# EAGLE schematic MiniBoard (EAGLE 9.6.2)
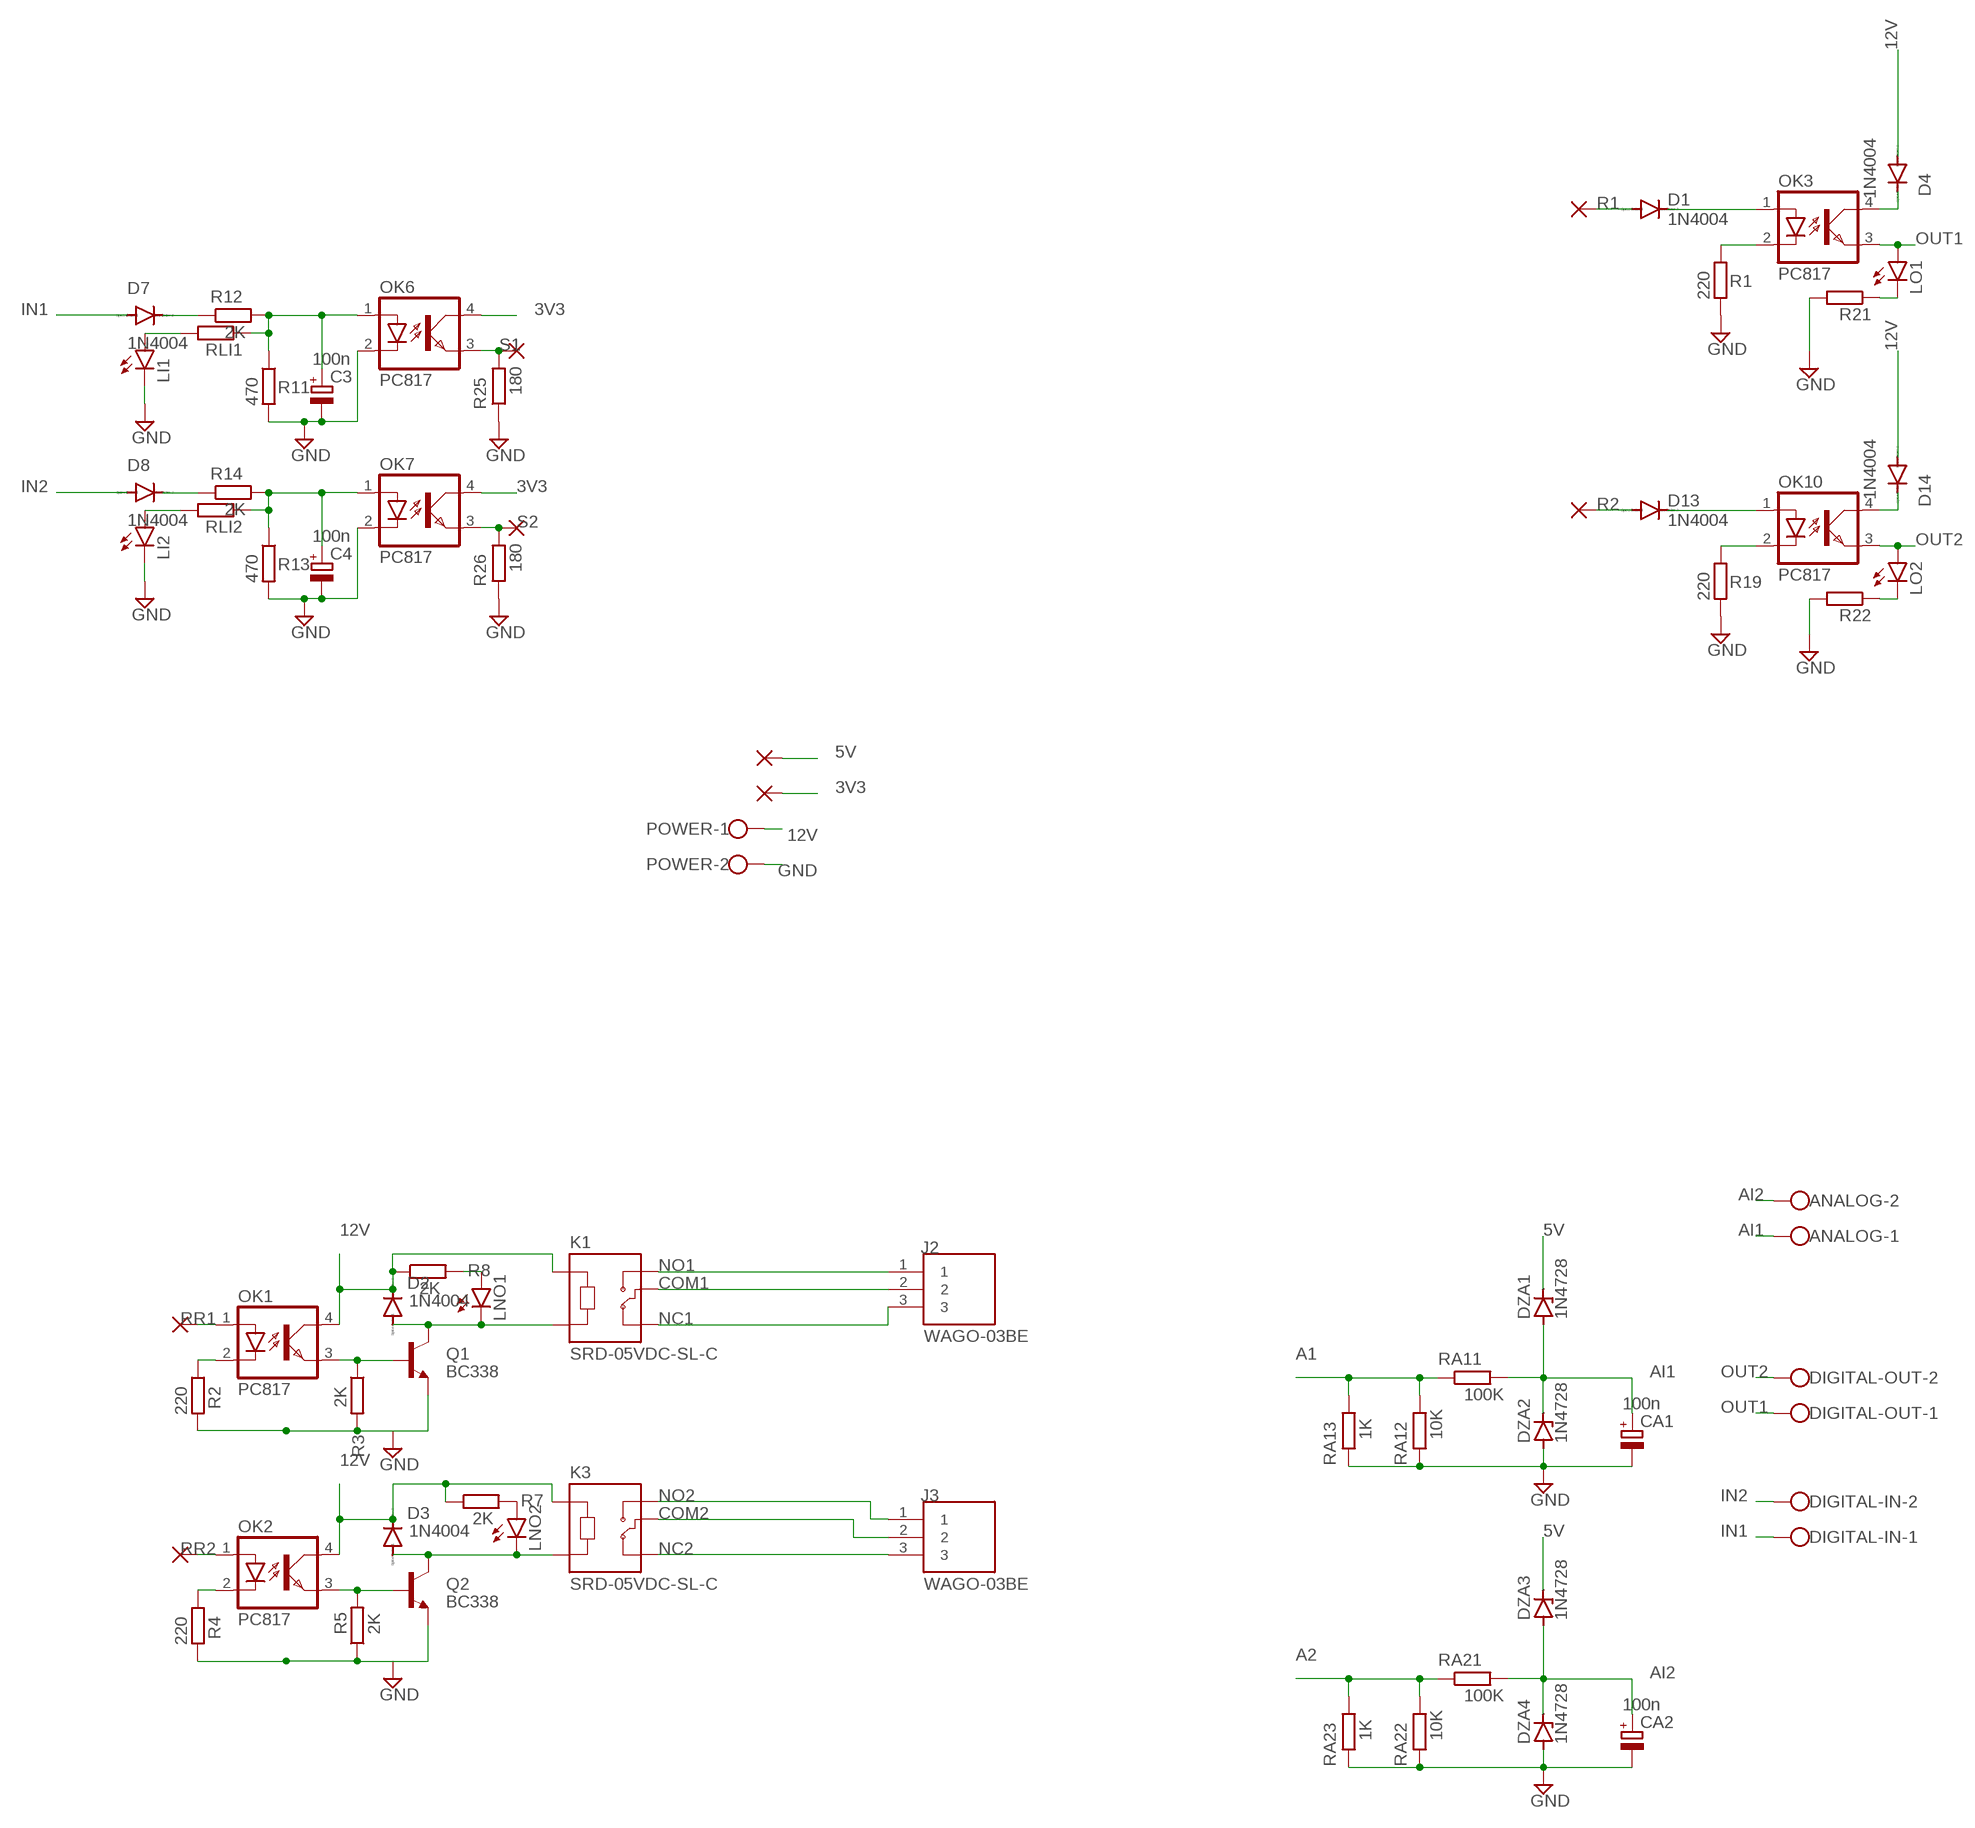
[diagram p0: schematic, sheet 1]

## Parts
ANALOG  W237-102  [W237-102]
C3  100n  CPOL-EUE5-6  [E5-6]
C4  100n  CPOL-EUE5-6  [E5-6]
CA1  100n  CPOL-EUE5-6  [E5-6]
CA2  100n  CPOL-EUE5-6  [E5-6]
D1  1N4004  [DO41-10]
D2  1N4004  [DO41-10]
D3  1N4004  [DO41-10]
D4  1N4004  [DO41-10]
D7  1N4004  [DO41-10]
D8  1N4004  [DO41-10]
D13  1N4004  [DO41-10]
D14  1N4004  [DO41-10]
DIGITAL-IN  W237-102  [W237-102]
DIGITAL-OUT  W237-102  [W237-102]
DZA1  1N4728  [DO41Z10]
DZA2  1N4728  [DO41Z10]
DZA3  1N4728  [DO41Z10]
DZA4  1N4728  [DO41Z10]
J2  WAGO-03BE  [CUI_TB006-508-03BE]
J3  WAGO-03BE  [CUI_TB006-508-03BE]
K1  SRD-05VDC-SL-C  [RELAY_SRD-05VDC-SL-C]
K3  SRD-05VDC-SL-C  [RELAY_SRD-05VDC-SL-C]
LI1  LED3MM  [LED3MM]
LI2  LED3MM  [LED3MM]
LNO1  LED3MM  [LED3MM]
LNO2  LED3MM  [LED3MM]
LO1  LED3MM  [LED3MM]
LO2  LED3MM  [LED3MM]
OK1  PC817  [DIL04]
OK2  PC817  [DIL04]
OK3  PC817  [DIL04]
OK6  PC817  [DIL04]
OK7  PC817  [DIL04]
OK10  PC817  [DIL04]
PAD1  WIREPAD1,6/0,9  [1,6/0,9]
PAD2  WIREPAD1,6/0,9  [1,6/0,9]
PAD3  WIREPAD1,6/0,9  [1,6/0,9]
PAD4  WIREPAD1,6/0,9  [1,6/0,9]
PAD5  WIREPAD1,6/0,9  [1,6/0,9]
PAD6  WIREPAD1,6/0,9  [1,6/0,9]
PAD79  WIREPAD1,6/0,9  [1,6/0,9]
PAD80  WIREPAD1,6/0,9  [1,6/0,9]
POWER  W237-102  [W237-102]
Q1  BC338  [TO92-EBC]
Q2  BC338  [TO92-EBC]
R1  220  R-EU_0309/12  [0309/12]
R2  220  R-EU_0309/12  [0309/12]
R3  2K  R-EU_0309/12  [0309/12]
R4  220  R-EU_0309/12  [0309/12]
R5  2K  R-EU_0309/12  [0309/12]
R7  2K  R-EU_0309/12  [0309/12]
R8  2K  R-EU_0309/12  [0309/12]
R11  470  R-EU_0309/12  [0309/12]
R12  2K  R-EU_0309/12  [0309/12]
R13  470  R-EU_0309/12  [0309/12]
R14  2K  R-EU_0309/12  [0309/12]
R19  220  R-EU_0309/12  [0309/12]
R21  R-EU_0309/12  [0309/12]
R22  R-EU_0309/12  [0309/12]
R25  180  R-EU_0309/12  [0309/12]
R26  180  R-EU_0309/12  [0309/12]
RA11  100K  R-EU_0309/12  [0309/12]
RA12  10K  R-EU_0309/12  [0309/12]
RA13  1K  R-EU_0309/12  [0309/12]
RA21  100K  R-EU_0309/12  [0309/12]
RA22  10K  R-EU_0309/12  [0309/12]
RA23  1K  R-EU_0309/12  [0309/12]
RLI1  R-EU_0309/12  [0309/12]
RLI2  R-EU_0309/12  [0309/12]

## Nets
3V3: OK6.4(COL) OK7.4(COL) PAD5.1(P)
5V: DZA1.C DZA3.C PAD6.1(P)
12V: D2.C D3.C D4.A D14.A K1.A1 K3.A1 OK1.4(COL) OK2.4(COL) POWER.1 R7.1 R8.1
A1: RA11.1 RA12.2 RA13.2
A2: RA21.1 RA22.2 RA23.2
AI1: ANALOG.1 CA1.+ DZA1.A DZA2.C RA11.2
AI2: ANALOG.2 CA2.+ DZA3.A DZA4.C RA21.2
COM1: J2.2 K1.COM
COM2: J3.2 K3.COM
GND: C3.- C4.- CA1.- CA2.- DZA2.A DZA4.A LI1.K(C) LI2.K(C) OK6.2(C) OK7.2(C) POWER.2 Q1.E Q2.E R1.2 R2.2 R3.2 R4.2 R5.1 R11.2 R13.2 R19.2 R21.2 R22.2 R25.1 R26.1 RA12.1 RA13.1 RA22.1 RA23.1
IN1: D7.A DIGITAL-IN.1
IN2: D8.A DIGITAL-IN.2
N$1: OK2.2(C) R4.1
N$2: OK1.2(C) R2.1
N$3: OK1.3(EMIT) Q1.B R3.1
N$4: D3.A K3.A2 LNO2.K(C) Q2.C
N$6: OK2.3(EMIT) Q2.B R5.2
N$7: LNO2.A R7.2
N$10: LNO1.A R8.2
N$11: D2.A K1.A2 LNO1.K(C) Q1.C
N$15: D1.C OK3.1(A)
N$16: OK3.2(C) R1.1
N$18: D4.C OK3.4(COL)
N$19: C3.+ OK6.1(A) R11.1 R12.2 RLI1.1
N$20: D7.C R12.1
N$21: C4.+ OK7.1(A) R13.1 R14.2 RLI2.1
N$22: D8.C R14.1
N$24: LI2.A RLI2.2
N$26: D13.C OK10.1(A)
N$27: OK10.2(C) R19.1
N$29: LI1.A RLI1.2
N$30: LO1.K(C) R21.1
N$31: LO2.K(C) R22.1
N$52: D14.C OK10.4(COL)
NC1: J2.3 K1.NC
NC2: J3.3 K3.NC
NO1: J2.1 K1.NO
NO2: J3.1 K3.NO
OUT1: DIGITAL-OUT.1 LO1.A OK3.3(EMIT)
OUT2: DIGITAL-OUT.2 LO2.A OK10.3(EMIT)
R1: D1.A PAD79.1(P)
R2: D13.A PAD80.1(P)
RR1: OK1.1(A) PAD4.1(P)
RR2: OK2.1(A) PAD3.1(P)
S1: OK6.3(EMIT) PAD1.1(P) R25.2
S2: OK7.3(EMIT) PAD2.1(P) R26.2

## Library data of the parts
ANALOG DIGITAL-IN DIGITAL-OUT POWER = con-wago-500:W237-102: WAGO SCREW CLAMP; MPN: 237-102; OC_FARNELL: unknown; OC_NEWARK: 70K9898
C3 C4 CA1 CA2 = rcl-ws:CPOL-EU: POLARIZED CAPACITOR, European symbol; SPICEPREFIX: C
D1-D4 D7 D8 D13 D14 = diode:1N4004: DIODE general purpose rectifier, 1 A
DZA1-DZA4 = diode-ws:1N4728: Z DIODE 3.3 V, 1W, 5 percent
J2 J3 = TB006-508-03BE:WAGO-03BE: Check availability <https://pricing.snapeda.com/parts/TB006-508-03BE/Same%20Sky/view-part?ref=eda>; AVAILABILITY: In Stock; CHECK_PRICES: https://www.snapeda.com/parts/TB006-508-03BE/Same+Sky/view-part/?ref=eda; DESCRIPTION: 2~24 Poles, Screw Type, Horizontal, 5.08 Pitch, 26~14 (AWG), Terminal Block Connector; MF: Same Sky; MP: TB006-508-03BE; PACKAGE: None; PRICE: None; SNAPEDA_LINK: https://www.snapeda.com/parts/TB006-508-03BE/Same+Sky/view-part/?ref=snap
K1 K3 = SRD-05VDC-SL-C:SRD-05VDC-SL-C: 5V Trigger Relay Module For Arduino And Raspberry Pi 5V Trigger Relay Module For Arduino And Raspberry Pi Check availability <https://pricing.snapeda.com/parts/SRD-05VDC-SL-C/Songle%20Relay/view-part?ref=eda>; AVAILABILITY: In Stock; CHECK_PRICES: https://www.snapeda.com/parts/SRD-05VDC-SL-C/Songle+Relay/view-part/?ref=eda; DESCRIPTION: 5V Trigger Relay Module For Arduino And Raspberry Pi 5V Trigger Relay Module For Arduino And Raspberry Pi; MF: Songle Relay; MP: SRD-05VDC-SL-C; PACKAGE: NON STANDARD-5 Songle Relay; PRICE: None; SNAPEDA_LINK: https://www.snapeda.com/parts/SRD-05VDC-SL-C/Songle+Relay/view-part/?ref=snap
LI1 LI2 LNO1 LNO2 LO1 LO2 = led_WS:LED: LED OSRAM: - CHIPLED LG R971, LG N971, LY N971, LG Q971, LY Q971, LO R971, LY R971 LH N974, LH R974 LS Q976, LO Q976, LY Q976 LO Q996 - Hyper CHIPLED LW Q18S LB Q993, LB Q99A, LB R99A - SideLED LS A670, LO A670, LY A670, LG A670, LP A670 LB A673, LV A673, LT A673, LW A673 LH A674 LY A675 LS A676, LA A676, LO A676, LY A676, LW A676 LS A679, LY A679, LG A679 - Hyper Micro SIDELED® LS Y876, LA Y876, LO Y876, LY Y876 LT Y87S - SmartLED LW L88C, LW L88S LB L89C, LB L89S, LG L890 LS L89K, LO L89K, LY L89K LS L896, LA L896, LO L896, LY L896 - TOPLED LS T670, LO T670, LY T670, LG T670, LP T670 LSG T670, LSP T670, LSY T670, LOP T670, LYG T670 LG T671, LOG T671, LSG T671 LB T673, LV T673, LT T673, LW T673 LH T674 LS T676, LA T676, LO T676, LY T676, LB T676, LH T676, LSB T676, LW T676 LB T67C, LV T67C, LT T67C, LS T67K, LO T67K, LY T67K, LW E67C LS E67B, LA E67B, LO E67B, LY E67B, LB E67C, LV E67C, LT E67C LW T67C LS T679, LY T679, LG T679 LS T770, LO T770, LY T770, LG T770, LP T770 LB T773, LV T773, LT T773, LW T773 LH T774 LS E675, LA E675, LY E675, LS T675 LS T776, LA T776, LO T776, LY T776, LB T776 LHGB T686 LT T68C, LB T68C - Hyper Mini TOPLED® LB M676 - Mini TOPLED Santana® LG M470 LS M47K, LO M47K, LY M47K Source: http://www.osram.convergy.de LUXEON: - LUMILED® LXK2-PW12-R00, LXK2-PW12-S00, LXK2-PW14-U00, LXK2-PW14-V00 LXK2-PM12-R00, LXK2-PM12-S00, LXK2-PM14-U00 LXK2-PE12-Q00, LXK2-PE12-R00, LXK2-PE12-S00, LXK2-PE14-T00, LXK2-PE14-U00 LXK2-PB12-K00, LXK2-PB12-L00, LXK2-PB12-M00, LXK2-PB14-N00, LXK2-PB14-P00, LXK2-PB14-Q00 LXK2-PR12-L00, LXK2-PR12-M00, LXK2-PR14-Q00, LXK2-PR14-R00 LXK2-PD12-Q00, LXK2-PD12-R00, LXK2-PD12-S00 LXK2-PH12-R00, LXK2-PH12-S00 LXK2-PL12-P00, LXK2-PL12-Q00, LXK2-PL12-R00 Source: www.luxeon.com KINGBRIGHT: KA-3528ASYC Source: www.kingbright.com
OK1-OK3 OK6 OK7 OK10 = optocoupler:PC817: SHARP OPTO COUPLER; MPN: PC817X4J000F; OC_FARNELL: 9707727; OC_NEWARK: 97K7059
PAD1-PAD6 PAD79 PAD80 = wirepad-ws:WIREPAD: Wire PAD connect wire on PCB
Q1 Q2 = transistor-npn:BC338*: NPN Transistor
R1-R5 R7 R8 R11-R14 R19 R21 R22 R25 R26 RA11-RA13 RA21-RA23 RLI1 RLI2 = rcl-ws:R-EU_: RESISTOR, European symbol; SPICEPREFIX: R